# Altium schematic sheet Button.SchDoc
size A4
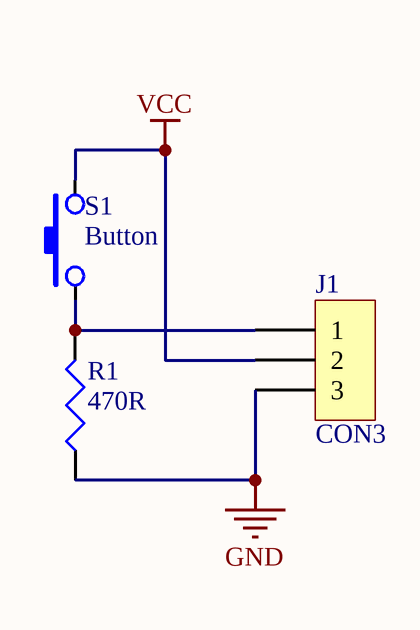
[diagram p0: Button.SchDoc]

## Parts
J1  CON3  [DevModule]
R1  470R  [6-0805_N]
S1  Button  [KFCA06]

## Nets
GND: J1.3 R1.1
VCC: J1.2 S1.2
NetJ1_1: J1.1 R1.2 S1.1

## Library data of the parts
J1 = CON3: Connector
R1 = RES1_1
S1 = SW-PB